# Altium schematic sheet Sensor Suite 2.SchDoc
size A4; SheetNumber: 5; SheetTotal: 6
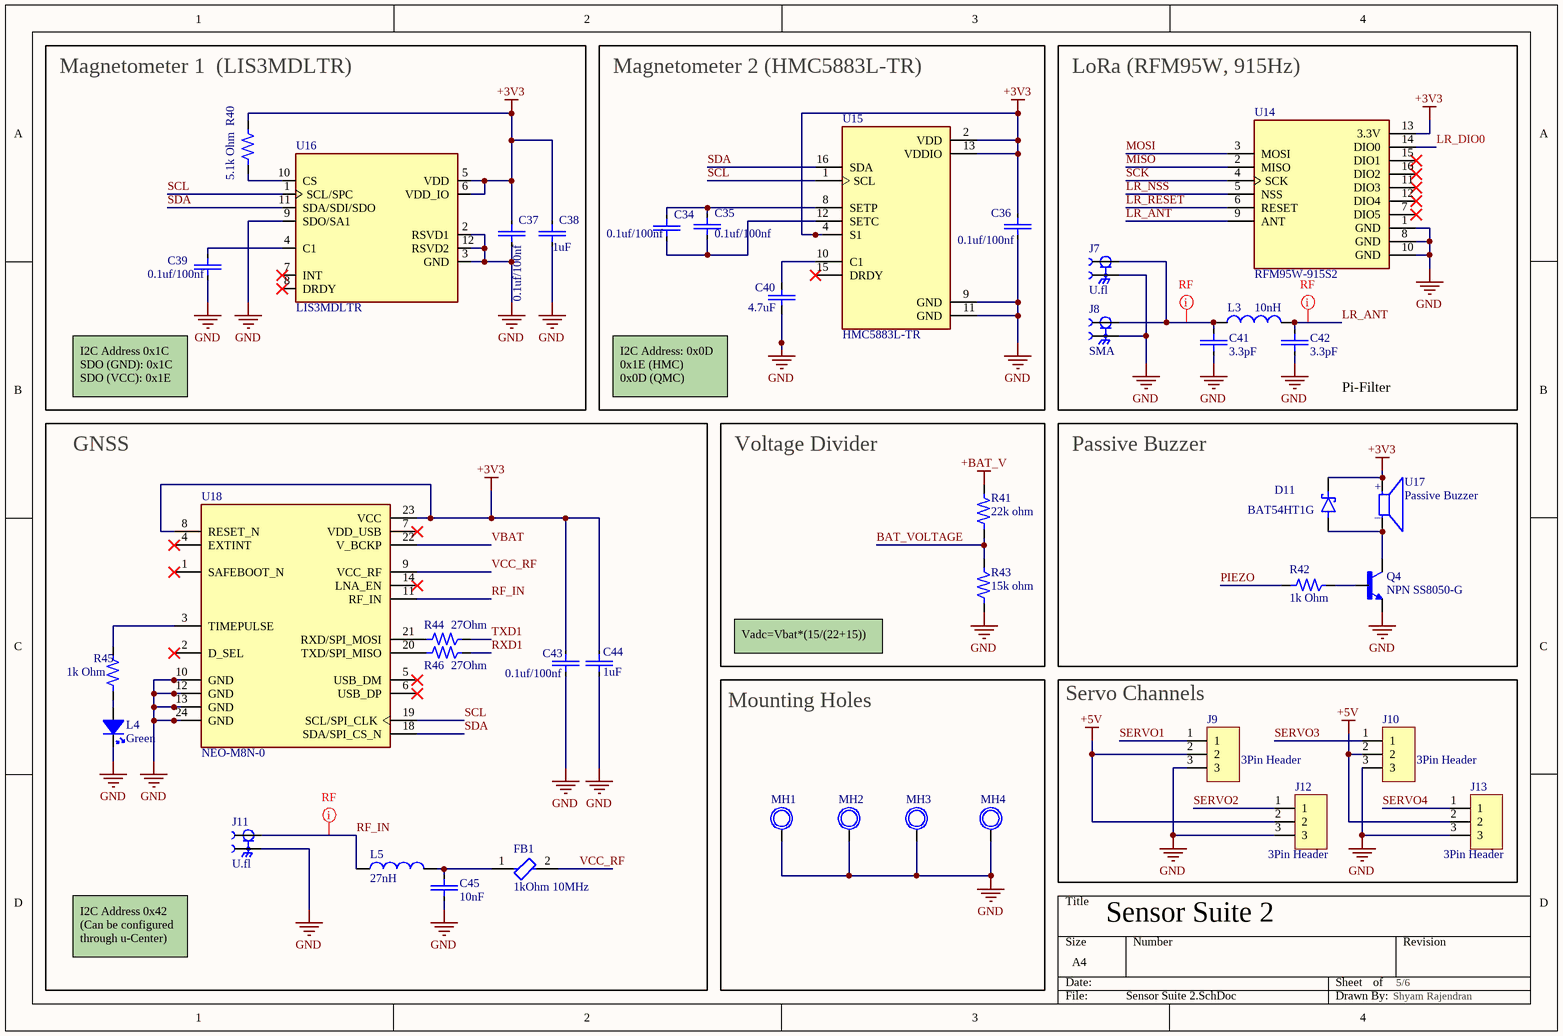
[diagram p0: Sensor Suite 2.SchDoc]

## Parts
C34  0.1uf/100nf  [0.1uF Capacitor]
C35  0.1uf/100nf  [0.1uF Capacitor]
C36  0.1uf/100nf  [0.1uF Capacitor]
C37  0.1uf/100nf  [0.1uF Capacitor]
C38  1uF  [10uf Capacitor]
C39  0.1uf/100nf  [0.1uF Capacitor]
C40  4.7uF  [1k 0805 Resistor]
C41  3.3pF  [3.3pF]
C42  3.3pF  [3.3pF]
C43  0.1uf/100nf  [0.1uF Capacitor]
C44  1uF  [10uf Capacitor]
C45  10nF  [3.3pF]
D11  BAT54HT1G  [SOD2513X110N]
FB1  1kOhm 10MHz  [1kOhm Ferrite bead 0402]
J7  U.fl  [U.fl]
J8  SMA  [SMA_CONNECTOR]
J9  3Pin Header  [3 Pin Header]
J10  3Pin Header  [3 Pin Header]
J11  U.fl  [U.fl]
J12  3Pin Header  [3 Pin Header]
J13  3Pin Header  [3 Pin Header]
L3  10nH  [0402 10nH]
L4  Green  [LED Green]
L5  27nH  [0402 10nH]
MH1  PMH 3.0  [PMH]  (value not drawn)
MH2  PMH 3.0  [PMH]  (value not drawn)
MH3  PMH 3.0  [PMH]  (value not drawn)
MH4  PMH 3.0  [PMH]  (value not drawn)
Q4  NPN SS8050-G  [Transistor_SS8050-G]
R40  5.1k Ohm  [RESC2012X60N]
R41  22k ohm  [1k 0805 Resistor]
R42  1k Ohm  [1k 0805 Resistor]
R43  15k ohm  [1k 0805 Resistor]
R44  27Ohm  [1k 0805 Resistor]
R45  1k Ohm  [1k 0805 Resistor]
R46  27Ohm  [1k 0805 Resistor]
U14  RFM95W-915S2  [RFM95W-915S2]
U15  HMC5883L-TR  [HMC5883L-TR]
U16  LIS3MDLTR  [LIS3MDLTR]
U17  Passive Buzzer  [BuzzerCMT-7525-80-SMT-TR]
U18  NEO-M8N-0  [NEO-M8N-0]

## Blocks framed on the sheet
Magnetometer 1  (LIS3MDLTR): C37-C39 R40 U16
Magnetometer 2 (HMC5883L-TR): C34-C36 C40 U15
LoRa (RFM95W, 915Hz): C41 C42 J7 J8 L3 U14
GNSS: C43-C45 FB1 J11 L4 L5 R44-R46 U18
Voltage Divider: R41 R43
Passive Buzzer: D11 Q4 R42 U17
Mounting Holes: MH1-MH4
Servo Channels: J9 J10 J12 J13

## Nets
+3V3: C36.2 C37.2 C38.2 C43.2 C44.2 D11.C(K) R40.2 U14.13(3.3V) U15.2(VDD) U15.4(S1) U15.13(VDDIO) U16.5(VDD) U16.6(VDD_IO) U17.P U18.8(RESET_N) U18.23(VCC)
+5V: J9.2 J10.2 J12.2 J13.2
+BAT_V: R41.2
GND: C36.1 C37.1 C38.1 C39.1 C40.1 C41.1 C42.1 C43.1 C44.1 C45.1 J7.GND J8.GND J9.3 J10.3 J11.GND J12.3 J13.3 L4.C MH1.GND MH2.GND MH3.GND MH4.GND Q4.2(E) R43.1 U14.1(GND) U14.8(GND) U14.10(GND) U15.9(GND) U15.11(GND) U16.2(RSVD1) U16.3(GND) U16.9(SDO/SA1) U16.12(RSVD2) U18.10(GND) U18.12(GND) U18.13(GND) U18.24(GND)
BAT_VOLTAGE: R41.1 R43.2
LR_ANT: C42.2 L3.2 U14.9(ANT)
LR_DIO0: U14.14(DIO0)
LR_NSS: U14.5(NSS)
LR_RESET: U14.6(RESET)
MISO: U14.2(MISO)
MOSI: U14.3(MOSI)
PIEZO: R42.1
RF_IN: J11.1 L5.1 U18.11(RF_IN)
RXD1: R46.2
SCK: U14.4(SCK)
SCL: U15.1(SCL) U16.1(SCL/SPC) U18.19(SCL/SPI_CLK)
SDA: U15.16(SDA) U16.11(SDA/SDI/SDO) U18.18(SDA/SPI_CS_N)
SERVO1: J9.1
SERVO2: J12.1
SERVO3: J10.1
SERVO4: J13.1
TXD1: R44.2
VBAT: U18.22(V_BCKP)
VCC_RF: FB1.2 U18.9(VCC_RF)
NetC34_1: C34.1 C35.1 U15.12(SETC)
NetC34_2: C34.2 C35.2 U15.8(SETP)
NetC39_2: C39.2 U16.4(C1)
NetC40_2: C40.2 U15.10(C1)
NetC41_2: C41.2 J7.1 J8.1 L3.1
NetC45_2: C45.2 FB1.1 L5.2
NetD11_A: D11.A Q4.3(C) U17.N
NetL4_A: L4.A R45.1
NetQ4_1: Q4.1(B) R42.2
NetR40_1: R40.1 U16.10(CS)
NetR44_1: R44.1 U18.21(RXD/SPI_MOSI)
NetR45_2: R45.2 U18.3(TIMEPULSE)
NetR46_1: R46.1 U18.20(TXD/SPI_MISO)

Not connected (* = marked no-connect by the designer): U14 7(DIO5)* 11(DIO3)* 12(DIO4)* 15(DIO1)* 16(DIO2)*; U15 15(DRDY)*; U16 7(INT)* 8(DRDY)*; U18 1(SAFEBOOT_N)* 2(D_SEL)* 4(EXTINT)* 5(USB_DM)* 6(USB_DP)* 7(VDD_USB)* 14(LNA_EN)*

## Layout directives
net class RF: LR_ANT, NetC41_2, RF_IN

## Notes on the sheet
- I2C Address 0x1C
  SDO (GND): 0x1C
  SDO (VCC): 0x1E
- I2C Address: 0x0D
  0x1E (HMC)
  0x0D (QMC)
- Pi-Filter <BMP280>
- Vadc=Vbat*(15/(22+15))
- Sensor Suite 2 <BMP280>
- I2C Address 0x42
  (Can be configured through u-Center)
- 5/6 <BMP280>
- Shyam Rajendran <BMP280>
- (in symbol Buzzer CMT-7525-80-SMT-TR) +; _

## Library data of the parts
C34-C37 C39 C43 = CC0805KRX7R9BB104: 0.1 uF, Multilayer Ceramic Capacitor, 50 V, ï¿½ 10%, X7R, 0805 [2012 Metric]; Manufacturer: Yageo; Value: 100nF; Voltage Rating: 50V; Insulation Resistance: 100GR; Supplier: Future Electronics; Supplier Part Number: 2986263; Manufacturer Part Number: CC0805KRX7R9BB104; RoHS: Yes; Category: Ceramic Capacitors; Stock: 2884000; Pricing: 4000=0.009, 12000=0.0088, 40000=0.0085, 80000=0.0083, 160000=0.008 (USD); Mounting Technology: Surface Mount; Case/Package: 0805; Pins: 2; Case Code (Metric): 2012; Case Code (Imperial): 0805; Material: Ceramic; Min Operating Temperature: -55°C; Max Operating Temperature: 125°C; Packaging: Tape and Reel; Tolerance: 10%; Dielectric: X7R; Series: CC; Package Quantity: 4000; Voltage: 50V; Termination: SMD/SMT; Length: 2mm; Height: 0.85mm; Depth: 1.25mm; Radiation Hardening: No; RoHS Compliant: Yes; Lead Free: 5697LeadFree; Reach SVHC Compliant: No; Halogen Free: 5694HalogenFree
C38 C44 = CC0805KKX7R6BB105: 1uF, Ceramic Capacitor, Multilayer, Ceramic, 10V, 10% +Tol, 10% -Tol, X7R, 15% TC,Surface Mount, 0805; Manufacturer: Yageo; Multilayer: Yes; Supplier: Future Electronics; Supplier Part Number: 2015429; Manufacturer Part Number: CC0805KKX7R6BB105; RoHS: Yes; Category: Ceramic Capacitors; Stock: 114000; Pricing: 3000=0.0123, 9000=0.012, 30000=0.0117, 60000=0.0116, 120000=0.0112 (USD); Mounting Technology: Surface Mount; Pins: 2; Dielectric Material: Ceramic; Package Shape: Rectangular; Case/Package: 0805; Terminal Finish: Nickel; Min Operating Temperature: -55°C; Max Operating Temperature: 125°C; JESD-609 Code: e3; Value: 1uF; Capacitor Type: Ceramic; Tolerance  (fill in as +-): 10%; Packaging: Tape and Reel; Tolerance (fill in as +-): 10%; Rated DC Voltage (URdc): 10V; Temperature Characteristics Code: X7R; Termination: Wraparound; Package Style: SMTMeter; Length: 2mm; Width: 1.25mm; Height: 1.25mm; Reach SVHC Compliant: Yes; RoHS Compliant: Yes; ComponentLink1URL: https://datasheet.ciiva.com:443/pdfs/VipMasterIC/IC/YAGO/YAGO-S-A0003557223/YAGO-S-A0003557223-1.pdf?src-supplier=IHS+Markit; ComponentLink1Description: https://datasheet.ciiva.com:443/pdfs/VipMasterIC/IC/YAGO/YAGO-S-A0003557223/YAGO-S-A0003557223-1.pdf?src-supplier=IHS+Markit
C40 = 4.7uF Capacitor: 0603, 25V
C41 C42 = 3.3pF Capacitor: 0402
C45 = 10nf Capacitor: TCC0402X7R103J500AT-CCTC-SMT ceramic capacitors 0402 X7R 103J(10nF)±5.0% Rated voltage:50V thickness:0.50mm tape
D11 = BAT54HT1G: BAT54HT1G-ONSEMI-BAT54HT1G-Small Signal Schottky Diode, Single, 30 V, 200 mA, 800 mV, 600 mA, 150 °C; MF: Infineon Technologies; MP: BAS3010A03WE6327HTSA1; Price: None; Mouser-Purchase-URL: https://snapeda.com/shop?store=Mouser&id=447647; Value: *; Arrow_Electronics-Purchase-URL: https://snapeda.com/shop?store=Arrow+Electronics&id=447647; Package: SOD-323 Infineon; DigiKey-Purchase-URL: https://snapeda.com/shop?store=DigiKey&id=447647; SnapEDA_Link: https://www.snapeda.com/parts/BAS3010A03WE6327HTSA1/Infineon%20Technologies/view-part/447647/?ref=snap; Availability: Unavailable
FB1 = BLM21AG102SN1D: Ferrite Beads Multi-Layer 1KOhm 25% 100MHz 600mA 270mOhm DCR 0805 T/R; Manufacturer: Murata; Material: Steel,Ferrite; Impedance: 1kR; Max Current Rating: 500mA; Max DC Current: 200mA; DC Resistance (DCR): 280mR; Number of Lines: 1; Shielding: Unshielded; ESR: 270mR; Supplier: Mouser; Supplier Part Number: 81-BLM21AG102SN1; Manufacturer Part Number: BLM21AG102SN1D; RoHS: Yes; Category: Ferrite Beads and Chips; Stock: 100884; Pricing: 1=0.16, 10=0.083, 50=0.083, 100=0.064, 1000=0.055, 10000=0.038 (USD); Case/Package: 0805; Pins: 2; Core Material: Ferrite; Case Code (Metric): 2012; Case Code (Imperial): 0805; Weight: 0.000194oz; Min Operating Temperature: -55°C; Max Operating Temperature: 125°C; Tolerance: 25%; Package Quantity: 1; Packaging: Tape and Reel; Current Rating: 500mA; Termination: SMD/SMT; Test Frequency: 100MHz; DC Current: 200mA; Frequency: 100MHz; Number of Circuits: 1; Series: BLM21A; DC Resistance-Max: 280mR; RMS Current (Irms): 600mA; Length: 2mm; Width: 1.25mm; Height: 0.85mm; Depth: 1.25mm; Radiation Hardening: No; Reach SVHC Compliant: No; Military Standard: Not; Lead Free: Lead Free; RoHS Compliant: Yes; ComponentLink1URL: https://datasheet.ciiva.com/19454/1845136-19454717.pdf?src-supplier=Jameco; ComponentLink1Description: https://datasheet.ciiva.com/19454/1845136-19454717.pdf?src-supplier=Jameco; ComponentLink2URL: https://datasheet.ciiva.com/41449/001172322-da-01-en-drossel-0805-1000r-2-0x1-25mm-4000st-41449636.pdf?src-supplier=Conrad; ComponentLink2Description: https://datasheet.ciiva.com/41449/001172322-da-01-en-drossel-0805-1000r-2-0x1-25mm-4000st-41449636.pdf?src-supplier=Conrad; ComponentLink3URL: https://datasheet.ciiva.com/29347/442432-da-01-en-chip-drossel-0805-1000r-200ma-2-0x1-25mm-29347996.pdf?src-supplier=Conrad; ComponentLink3Description: https://datasheet.ciiva.com/29347/442432-da-01-en-chip-drossel-0805-1000r-200ma-2-0x1-25mm-29347996.pdf?src-supplier=Conrad; ComponentLink4URL: https://datasheet.ciiva.com/3082/l0110s0100blm21a-3082728.pdf?src-supplier=Avnet; ComponentLink4Description: https://datasheet.ciiva.com/3082/l0110s0100blm21a-3082728.pdf?src-supplier=Avnet; ComponentLink5URL: https://datasheet.ciiva.com/8021/l0110s0100blm21a-8021548.pdf?src-supplier=Element14; ComponentLink5Description: https://datasheet.ciiva.com/8021/l0110s0100blm21a-8021548.pdf?src-supplier=Element14; ComponentLink6URL: https://datasheet.ciiva.com/8021/l0110s0100blm21a-8021550.pdf?src-supplier=Element14; ComponentLink6Description: https://datasheet.ciiva.com/8021/l0110s0100blm21a-8021550.pdf?src-supplier=Element14; ComponentLink7URL: https://datasheet.ciiva.com/6212/l0110s0100blm21a-6212347.pdf?src-supplier=Digikey; ComponentLink7Description: https://datasheet.ciiva.com/6212/l0110s0100blm21a-6212347.pdf?src-supplier=Digikey; ComponentLink8URL: https://datasheet.ciiva.com/6212/l0110s0100blm21a-6212345.pdf?src-supplier=Digikey; ComponentLink8Description: https://datasheet.ciiva.com/6212/l0110s0100blm21a-6212345.pdf?src-supplier=Digikey; ComponentLink9URL: https://datasheet.ciiva.com/6212/l0110s0100blm21a-6212318.pdf?src-supplier=Digikey; ComponentLink9Description: https://datasheet.ciiva.com/6212/l0110s0100blm21a-6212318.pdf?src-supplier=Digikey
J7 J11 = U.fl: ufl connector; MP: CONUFL001-SMD-T; Package: None; Price: None; Value: *; Availability: Unavailable
J8 = SMA_CONNECTOR: Straight SMA Connector; MP: altium_native_batch; Value: *; Package: None; Availability: Unavailable; Price: None
J9 J10 J12 J13 = Header 3pin
L3 = 10nH Inductor: 0402
L4 = LED Green: Green 0805
L5 = 27nH Inductor: 0402
MH1-MH4 = PMH: PMH 3.0mm
Q4 = SS8050-G: Trans Gp Bjt NPN 25V 1.5A 300MW 3-PIN SOT-23 T/r; Manufacturer: Comchip; Transition Frequency: 100MHz; Collector-emitter Voltage-Max: 400mV; Collector Base Voltage (VCBO): 40V; Collector Emitter Saturation Voltage: 500mV; Emitter Base Voltage (VEBO): 5V; hFE Min: 200; Number of Elements: 1; Supplier: Digikey; Supplier Part Number: 641-1790-1-ND; Manufacturer Part Number: SS8050-G; RoHS: Yes; Category: Transistors; Stock: 150601; Pricing: 1=0.24, 10=0.148, 100=0.0921, 500=0.06754, 1000=0.05958 (USD); Mounting Technology: Surface Mount; Case/Package: TO-236-3; Max Operating Temperature: 150°C; Packaging: Cut Tape; Max Collector Current: 1.5A; Max Power Dissipation: 300mW; Collector Emitter Breakdown Voltage: 25V; Max Breakdown Voltage: 25V; Series: -; Power Dissipation: 300mW; Height: 1.15mm; RoHS Compliant: Yes; ComponentLink1URL: http://www.comchiptech.com/admin/files/product/SS8050-G RevA181526.pdf?src-supplier=Digikey; ComponentLink1Description: http://www.comchiptech.com/admin/files/product/SS8050-G RevA181526.pdf?src-supplier=Digikey
R40 = RC0805FR-075K1L: 5.1k Ohm, 0805, 0.125W, 150V, 1% +/-Tol, 100ppm/Cel, Surface Mount; Manufacturer: Yageo; Additional Feature: LASER TRIMMABLE; Power: 125mW; Rated Temperature: 70°C; Value: 5.1kR; Temperature Coefficient (ppm/Cel): 100; Package Height: 0.5mm; Package Length: 2mm; Package Width: 1.25mm; Supplier: Future Electronics; Supplier Part Number: 5647425; Manufacturer Part Number: RC0805FR-075K1L; RoHS: Yes; Category: Chip SMD Resistors; Stock: 15000; Pricing: 5000=0.0021, 20000=0.002, 100000=0.0019, 200000=0.0018, 625000=0.0017 (USD); Mounting Technology: Surface Mount; Pins: 2; Package Shape: Rectangular; Case/Package: 0805; Terminal Finish: Nickel; Min Operating Temperature: -55°C; Max Operating Temperature: 155°C; Tolerance: 1%; JESD-609 Code: e3; Termination: Wraparound; Resistor Type: FIXED RESISTOR; Construction: Chip; Packaging: Tape and Reel; Technology: METAL GLAZE/THICK FILM; Working Voltage: 150V; Reach SVHC Compliant: Yes; RoHS Compliant: Yes; ComponentLink1URL: https://datasheet.ciiva.com:443/pdfs/VipMasterIC/IC/YAGO/YAGO-S-A0008145938/YAGO-S-A0008145938-1.pdf?src-supplier=IHS+Markit; ComponentLink1Description: https://datasheet.ciiva.com:443/pdfs/VipMasterIC/IC/YAGO/YAGO-S-A0008145938/YAGO-S-A0008145938-1.pdf?src-supplier=IHS+Markit; ComponentLink2URL: https://datasheet.ciiva.com/11808/0900766b8106beab-11808171.pdf?src-supplier=Rs; ComponentLink2Description: https://datasheet.ciiva.com/11808/0900766b8106beab-11808171.pdf?src-supplier=Rs; ComponentLink3URL: https://datasheet.ciiva.com/2456/pyu-r-int-thick-7-2456979.pdf?src-supplier=Digikey; ComponentLink3Description: https://datasheet.ciiva.com/2456/pyu-r-int-thick-7-2456979.pdf?src-supplier=Digikey; ComponentLink4URL: https://datasheet.ciiva.com/2456/pyu-r-int-thick-7-2456980.pdf?src-supplier=Digikey; ComponentLink4Description: https://datasheet.ciiva.com/2456/pyu-r-int-thick-7-2456980.pdf?src-supplier=Digikey; ComponentLink5URL: https://datasheet.ciiva.com/15189/getdatasheetpartid-326574-15189996.pdf?src-supplier=Verical; ComponentLink5Description: https://datasheet.ciiva.com/15189/getdatasheetpartid-326574-15189996.pdf?src-supplier=Verical; ComponentLink6URL: https://datasheet.ciiva.com/2456/pyu-r-int-thick-7-2456978.pdf?src-supplier=Digikey; ComponentLink6Description: https://datasheet.ciiva.com/2456/pyu-r-int-thick-7-2456978.pdf?src-supplier=Digikey
R41 = 22k Resistor: 0805
R42 R45 = RC0805FR-071KL: 1k Ohm, 0805, SMD Chip Resistor , ï¿½ 1%, 125 mW,[2012 Metric], Thick Film, General Purpose; Manufacturer: Yageo; Value: 1kR; Power Rating: 125mW; Voltage Rating: 150V; Temperature Coefficient: 100ppm/°C; Supplier: Future Electronics; Supplier Part Number: 8126013; Manufacturer Part Number: RC0805FR-071KL; RoHS: Yes; Category: Chip SMD Resistors; Stock: 5450000; Pricing: 5000=0.0021, 20000=0.002, 100000=0.0019, 200000=0.0018, 625000=0.0017 (USD); Case/Package: 0805; Pins: 2; Case Code (Metric): 2012; Case Code (Imperial): 0805; Min Operating Temperature: -55°C; Max Operating Temperature: 155°C; Tolerance: 1%; Packaging: Tape and Reel; Voltage Rating (DC): 150V; Resistor Type: Thick Film; Series: RC; Number of Terminations: 2; Termination: SMD/SMT; Max Power Dissipation: 125mW; Resistance Tolerance: 1%; Package Quantity: 1; Features: Moisture Resistant; Construction: Rectangular; Voltage Rating (AC): 150V; Length: 0.079inch; Width: 0.049inch; Height: 0.024inch; Depth: 1.25mm; RoHS Compliant: Yes; Reach SVHC Compliant: No; Military Standard: Not; Lead Free: Lead Free
R43 = 15k Resistor: 0805
R44 R46 = RT0805FRE0727RL: 27 Ohm, Res Thin Film 0805 1% 1/8W ±50ppm/°C Molded SMD SMD Paper T/R; Manufacturer: Yageo; Value: 27R; Power Rating: 125mW; Voltage Rating (DC): 150V; Supplier: Future Electronics; Supplier Part Number: 9105398; Manufacturer Part Number: RT0805FRE0727RL; RoHS: Yes; Category: Chip SMD Resistors; Stock: 30000; Pricing: 5000=0.0055, 20000=0.0053, 50000=0.0051, 125000=0.005, 200000=0.0048 (USD); Case/Package: 0805; Pins: 2; Case Code (Metric): 2012; Case Code (Imperial): 0805; Contact Plating: Tin,Matte; Min Operating Temperature: -55°C; Max Operating Temperature: 125°C; Tolerance: 1%; Packaging: Tape and Reel; Package Quantity: 5000; Number of Terminations: 2; Temperature Coefficient: 50ppm/°C; Max Power Dissipation: 125mW; Series: RT; Voltage Rating: 150V; Resistor Type: Thin Film; Termination: SMD/SMT; Resistance Tolerance: 1%; Length: 0.079inch; Width: 0.049inch; Height: 0.024inch; RoHS Compliant: Yes; Reach SVHC Compliant: Unknown; ComponentLink1URL: https://datasheet.ciiva.com/2561/pyu-rt-1-to-0-05-rohs-l-5-2561109.pdf?src-supplier=Digikey; ComponentLink1Description: https://datasheet.ciiva.com/2561/pyu-rt-1-to-0-05-rohs-l-5-2561109.pdf?src-supplier=Digikey; ComponentLink2URL: https://datasheet.ciiva.com/8889/pyu-rt-1-to-0-05-rohs-l-4-8889865.pdf?src-supplier=Avnet; ComponentLink2Description: https://datasheet.ciiva.com/8889/pyu-rt-1-to-0-05-rohs-l-4-8889865.pdf?src-supplier=Avnet; ComponentLink3URL: https://datasheet.ciiva.com/7942/1392914-7942123.pdf?src-supplier=Element14; ComponentLink3Description: https://datasheet.ciiva.com/7942/1392914-7942123.pdf?src-supplier=Element14; ComponentLink4URL: https://datasheet.ciiva.com/7942/1392914-7942124.pdf?src-supplier=Element14; ComponentLink4Description: https://datasheet.ciiva.com/7942/1392914-7942124.pdf?src-supplier=Element14
U14 = RFM95W-915S2: RFM95(W) - Low Power Long Range Transceiver Module V1.0; Availability: Unavailable; MP: RFM95W-915S2; Value: *; Package: None; Price: None
U15 = HMC5883L-TR: Board Mount Hall Effect / Magnetic Sensors Sensors, Transducers Magnetic - Hall Effect, Digital Switch, Linear, Compass (ICs) - IC COMPASS 3 AXIS I2C 16LCC SMD; MF: STMicroelectronics; MP: HMC5883LTR; Price: None; SnapEDA_Link: https://www.snapeda.com/parts/HMC5883LTR/STMicroelectronics/view-part/?ref=snap; Check_prices: https://www.snapeda.com/parts/HMC5883LTR/STMicroelectronics/view-part/?ref=eda; Package: LCC-16 STMicroelectronics; Availability: Not in stock; Value: *
U16 = LIS3MDLTR: Magnetoresistive Sensor X, Y, Z Axis 12-LGA _2x2_; MF: STMicroelectronics; Availability: Unavailable; Price: None; SnapEDA_Link: https://www.snapeda.com/parts/LIS3MDLTR/STMicroelectronics/view-part/382740/?ref=snap; Package: VFLGA-12 STMicroelectronics; Value: *; MP: LIS3MDLTR
U17 = Buzzer CMT-7525-80-SMT-TR: 7.5 mm, 3.6 Vo-p, 80 dB, Surface Mount (SMT), Magnetic Audio Transducer Buzzer; MF: CUI Devices; Value: *; Digi-Key_Part_Number: 102-CMT-7525-80-SMT-TR-ND; SnapEDA_Link: https://www.snapeda.com/parts/CMT-7525-80-SMT-TR/CUI+Devices/view-part/?ref=snap; Check_prices: https://www.snapeda.com/parts/CMT-7525-80-SMT-TR/CUI+Devices/view-part/?ref=eda; CUI_purchase_URL: https://www.cuidevices.com/product/audio/buzzers/audio-transducers/cmt-7525-80-smt-tr?utm_source=snapeda.com&utm_medium=referral&utm_campaign=snapedaBOM; Purchase-URL: https://pricing.snapeda.com/search/part/CMT-7525-80-SMT-TR/?ref=eda; Package: CUI Devices; MP: CMT-7525-80-SMT-TR
U18 = NEO-M8N-0: Ic Receiver Gps/Gnss 24lcc; Package: None; Price: None; Availability: Unavailable; MP: NEO-M8N-0; Value: *